# Altium project PCB_DUVBot_v0.00.PrjPCB
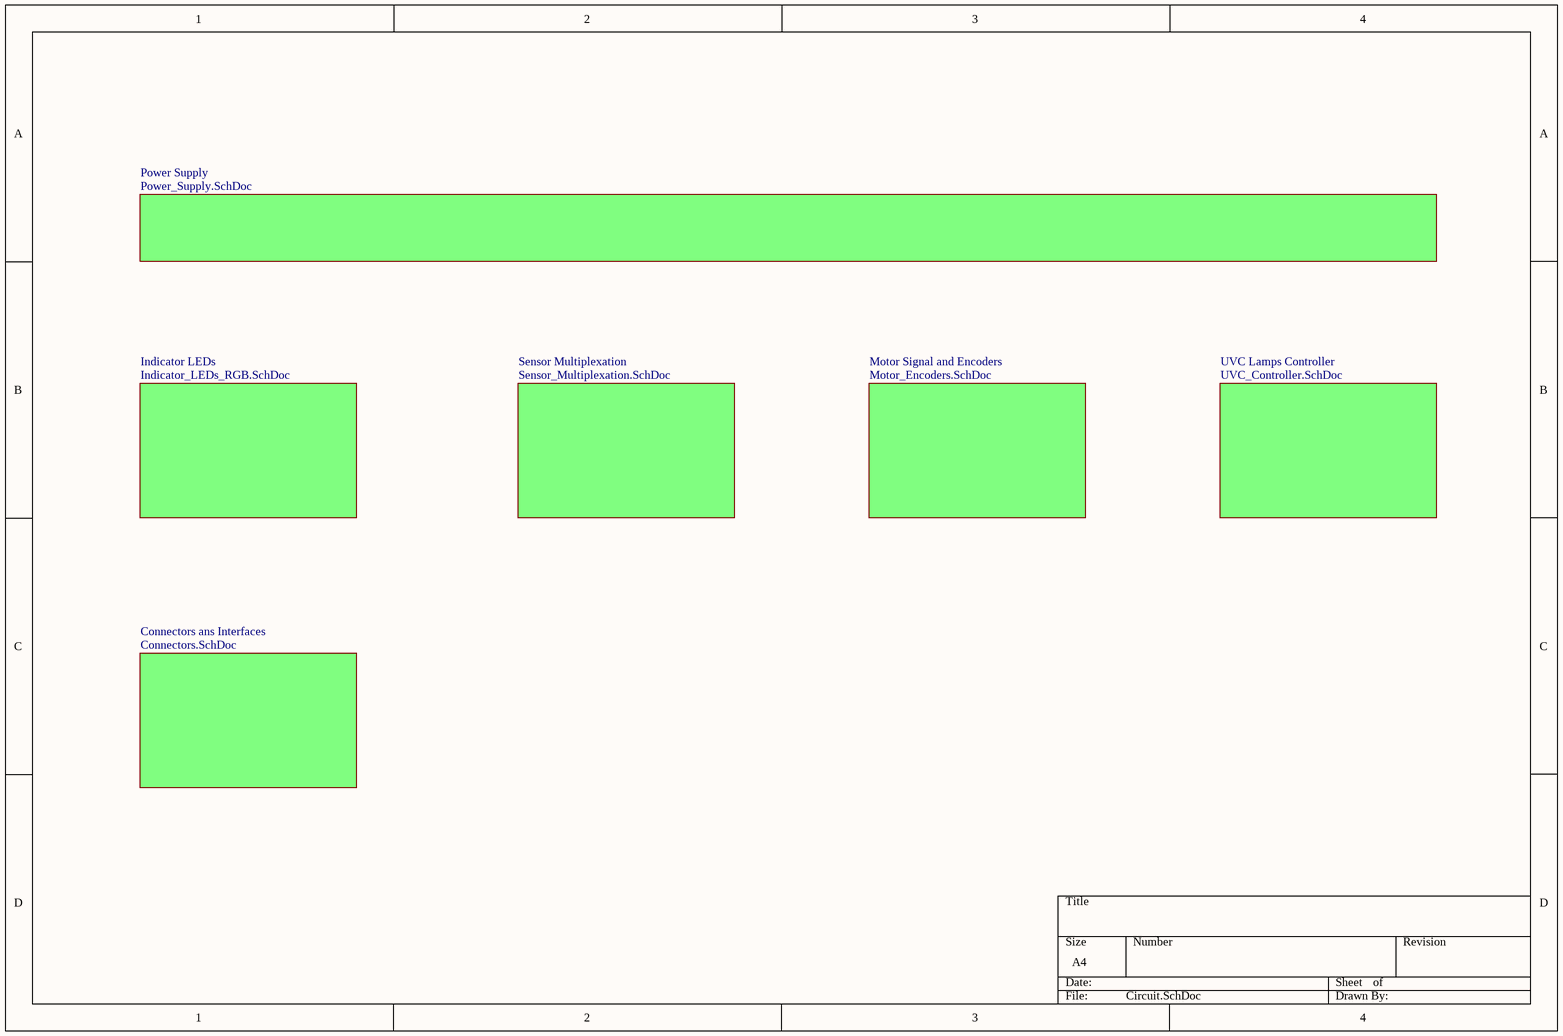
[diagram p0: Circuit.SchDoc]
4 sheets, 30 parts. Net scope: flat (ports and power ports of the same name join across sheets).
Board file: PCB_DUVBot_v0.00.PcbDoc
Sheets:
  Circuit.SchDoc
    Indicator LEDs = Indicator_LEDs_RGB.SchDoc
    Sensor Multiplexation = Sensor_Multiplexation.SchDoc
    Connectors ans Interfaces = Connectors.SchDoc

## Sheet Circuit.SchDoc
size A4

### Sub-sheets
Connectors ans Interfaces = Connectors.SchDoc: no entries
Indicator LEDs = Indicator_LEDs_RGB.SchDoc: no entries
Motor Signal and Encoders = Motor_Encoders.SchDoc (file not in this document): no entries
Power Supply = Power_Supply.SchDoc (file not in this document): no entries
Sensor Multiplexation = Sensor_Multiplexation.SchDoc: no entries
UVC Lamps Controller = UVC_Controller.SchDoc (file not in this document): no entries

## Sheet Indicator_LEDs_RGB.SchDoc
size A4

## Sheet Sensor_Multiplexation.SchDoc
size A4
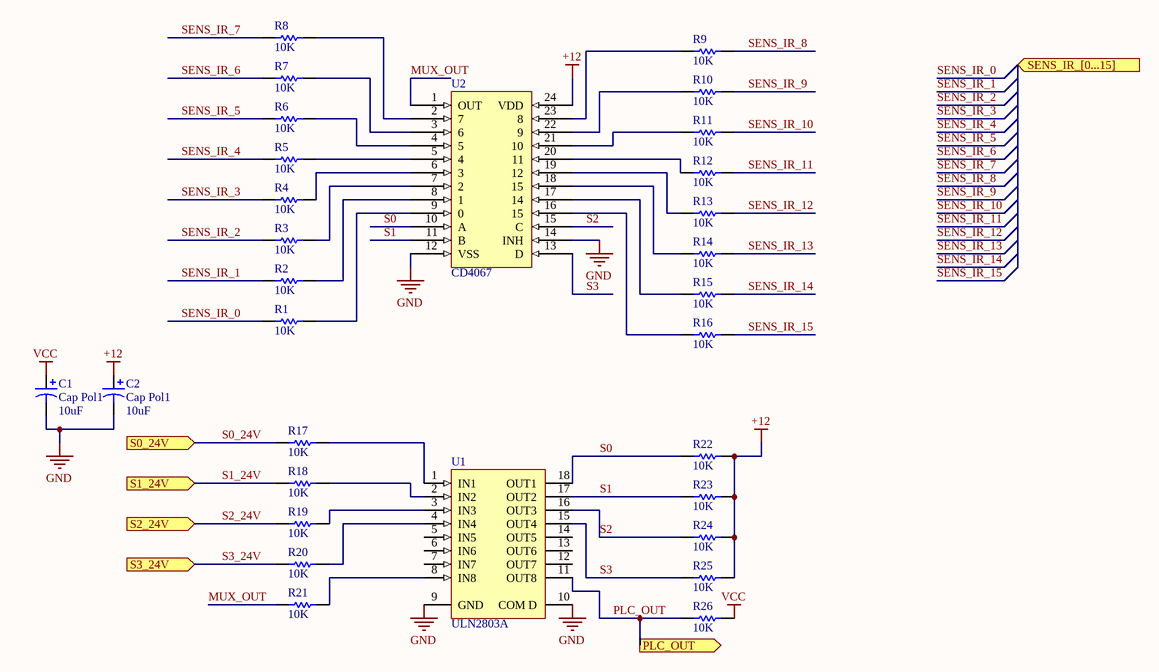
[diagram p1: Sensor_Multiplexation.SchDoc]

### Parts
C1  Cap Pol1  value 10uF  [RB7.6-15]
C2  Cap Pol1  value 10uF  [RB7.6-15]
R1  value 10K  [AXIAL-0.3]  (hidden comment: Res1)
R2  value 10K  [AXIAL-0.3]  (hidden comment: Res1)
R3  value 10K  [AXIAL-0.3]  (hidden comment: Res1)
R4  value 10K  [AXIAL-0.3]  (hidden comment: Res1)
R5  value 10K  [AXIAL-0.3]  (hidden comment: Res1)
R6  value 10K  [AXIAL-0.3]  (hidden comment: Res1)
R7  value 10K  [AXIAL-0.3]  (hidden comment: Res1)
R8  value 10K  [AXIAL-0.3]  (hidden comment: Res1)
R9  value 10K  [AXIAL-0.3]  (hidden comment: Res1)
R10  value 10K  [AXIAL-0.3]  (hidden comment: Res1)
R11  value 10K  [AXIAL-0.3]  (hidden comment: Res1)
R12  value 10K  [AXIAL-0.3]  (hidden comment: Res1)
R13  value 10K  [AXIAL-0.3]  (hidden comment: Res1)
R14  value 10K  [AXIAL-0.3]  (hidden comment: Res1)
R15  value 10K  [AXIAL-0.3]  (hidden comment: Res1)
R16  value 10K  [AXIAL-0.3]  (hidden comment: Res1)
R17  value 10K  [AXIAL-0.3]  (hidden comment: Res1)
R18  value 10K  [AXIAL-0.3]  (hidden comment: Res1)
R19  value 10K  [AXIAL-0.3]  (hidden comment: Res1)
R20  value 10K  [AXIAL-0.3]  (hidden comment: Res1)
R21  value 10K  [AXIAL-0.3]  (hidden comment: Res1)
R22  value 10K  [AXIAL-0.3]  (hidden comment: Res1)
R23  value 10K  [AXIAL-0.3]  (hidden comment: Res1)
R24  value 10K  [AXIAL-0.3]  (hidden comment: Res1)
R25  value 10K  [AXIAL-0.3]  (hidden comment: Res1)
R26  value 10K  [AXIAL-0.3]  (hidden comment: Res1)
U1  ULN2803A  [A18]
U2  CD4067

### Ports
PLC_OUT (out), S0_24V (in), S1_24V (in), S2_24V (in), S3_24V (in), SENS_IR_[0...15] (in)

### Nets
+12: C2.1 R22.2 R23.2 R24.2 R25.2 U2.24(VDD)
GND: C1.2 C2.2 U1.9(GND) U1.10(COM_D) U2.12(VSS) U2.14(INH)
VCC: C1.1 R26.2
MUX_OUT: R21.1 U2.1(OUT)
PLC_OUT: R26.1 U1.11(OUT8) ; port PLC_OUT
S0: R22.1 U1.18(OUT1) U2.10(A)
S0_24V: R17.1 ; port S0_24V
S1: R23.1 U1.17(OUT2) U2.11(B)
S1_24V: R18.1 ; port S1_24V
S2: R24.1 U1.16(OUT3) U2.15(C)
S2_24V: R19.1 ; port S2_24V
S3: R25.1 U1.15(OUT4) U2.13(D)
S3_24V: R20.1 ; port S3_24V
SENS_IR_0: R1.1
SENS_IR_1: R2.1
SENS_IR_2: R3.1
SENS_IR_3: R4.1
SENS_IR_4: R5.1
SENS_IR_5: R6.1
SENS_IR_6: R7.1
SENS_IR_7: R8.1
SENS_IR_8: R9.2
SENS_IR_9: R10.2
SENS_IR_10: R11.2
SENS_IR_11: R12.2
SENS_IR_12: R13.2
SENS_IR_13: R14.2
SENS_IR_14: R15.2
SENS_IR_15: R16.2
NetR1_2: R1.2 U2.9(0)
NetR2_2: R2.2 U2.8(1)
NetR3_2: R3.2 U2.7(2)
NetR4_2: R4.2 U2.6(3)
NetR5_2: R5.2 U2.5(4)
NetR6_2: R6.2 U2.4(5)
NetR7_2: R7.2 U2.3(6)
NetR8_2: R8.2 U2.2(7)
NetR9_1: R9.1 U2.23(8)
NetR10_1: R10.1 U2.22(9)
NetR11_1: R11.1 U2.21(10)
NetR12_1: R12.1 U2.20(11)
NetR13_1: R13.1 U2.19(12)
NetR14_1: R14.1 U2.18(15)
NetR15_1: R15.1 U2.17(14)
NetR16_1: R16.1 U2.16(15)
NetR17_2: R17.2 U1.1(IN1)
NetR18_2: R18.2 U1.2(IN2)
NetR19_2: R19.2 U1.3(IN3)
NetR20_2: R20.2 U1.4(IN4)
NetR21_2: R21.2 U1.8(IN8)

Not connected (* = marked no-connect by the designer): U1 5(IN5) 6(IN6) 7(IN7) 12(OUT7) 13(OUT6) 14(OUT5)

### Library data of the parts
C1 C2 = Cap Pol1: Polarized Capacitor (Radial); Published: 8-Jun-2000; LatestRevisionDate: 17-Jul-2002; LatestRevisionNote: Re-released for DXP Platform.; PackageReference: RB7.6-15; Publisher: Altium Limited; PackageDescription: Polarized Capacitor (Radial); 2 Leads
R1-R26 = Res1: Resistor; Published: 8-Jun-2000; LatestRevisionDate: 17-Jul-2002; LatestRevisionNote: Re-released for DXP Platform.; PackageReference: AXIAL-0.3; Publisher: Altium Limited; PackageDescription: Axial Device, Thru-Hole; 2 Leads; 0.3 in Pin Spacing
U1 = ULN2803A: High-Voltage, High-Current Darlington Array; Published: 13-Oct-2000; LatestRevisionDate: 06-Jun-2005; LatestRevisionNote: Stylized 3D Model Added.; DatasheetVersion: 1999; PackageVersion: 1999; PackageReference: A18; Publisher: Altium Limited; PackageDescription: DIP; 18 Leads; Row Spacing 7.62 mm; Pitch 2.54 mm; ComponentLink1Description: Manufacturer Link; ComponentLink1URL: http://www.allegromicro.com/

## Sheet Connectors.SchDoc
size A4